# Altium schematic sheet TESTPOINTS.SchDoc
size A3; SheetNumber: 12; SheetTotal: 14
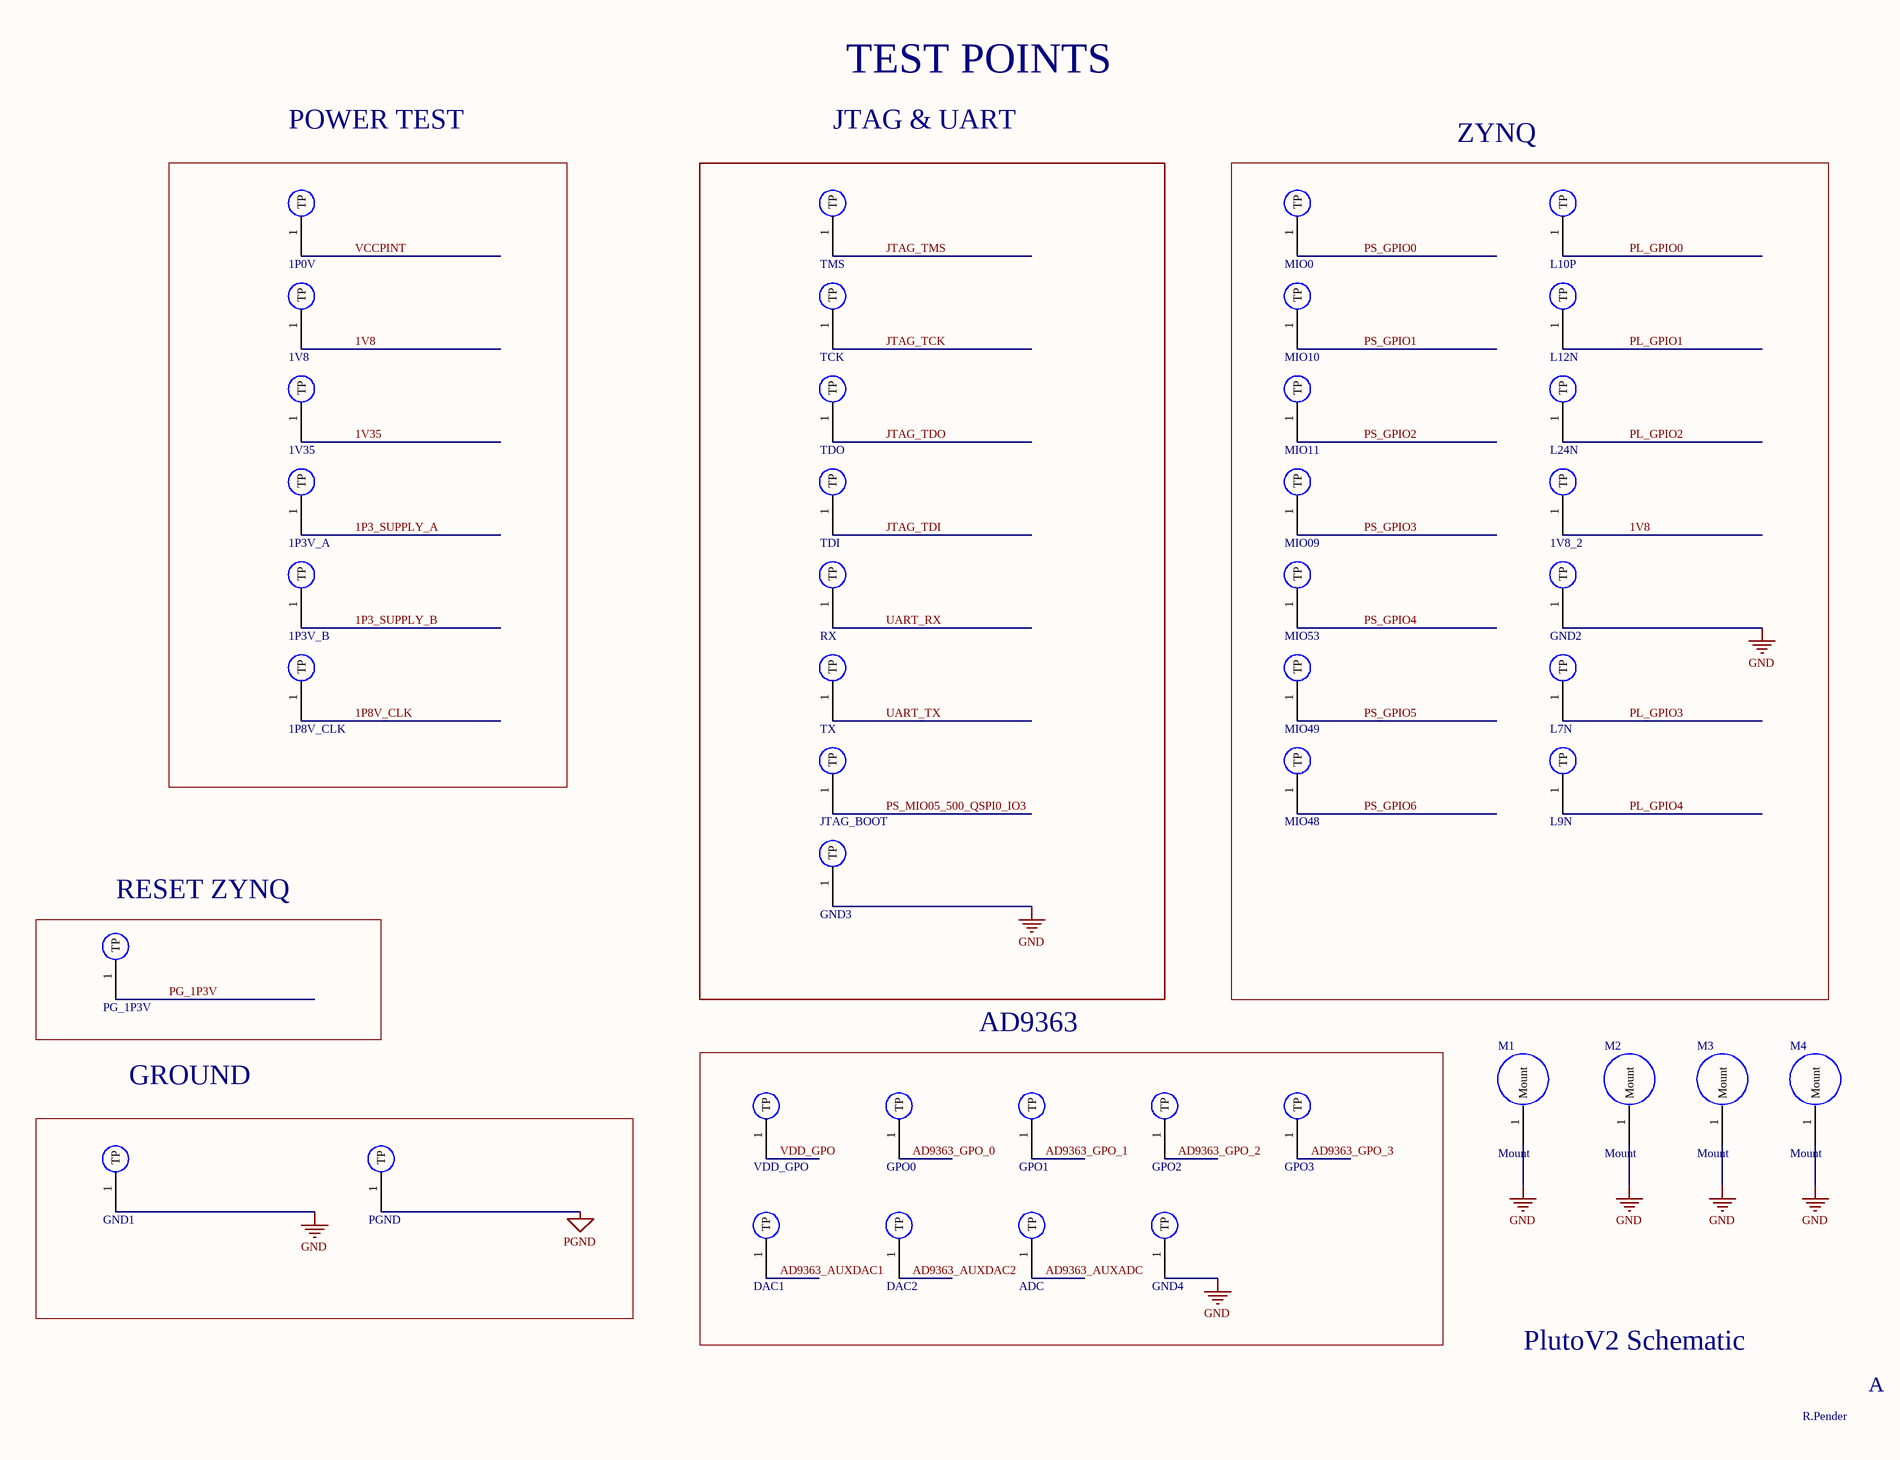
[diagram p0: TESTPOINTS.SchDoc, left]
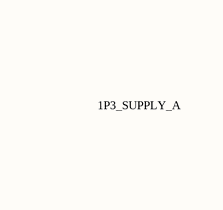
[diagram p1: TESTPOINTS.SchDoc, right]

## Parts
1P0V  TEST POINT  [TESTPOINT1]  (value not drawn)  (no BOM)
1P3V_A  TEST POINT  [TESTPOINT1]  (value not drawn)  (no BOM)
1P3V_B  TEST POINT  [TESTPOINT1]  (value not drawn)  (no BOM)
1P8V_CLK  TEST POINT  [TESTPOINT1]  (value not drawn)  (no BOM)
1V8  TEST POINT  [TESTPOINT1]  (value not drawn)  (no BOM)
1V8_2  TEST POINT  [TESTPOINT1]  (value not drawn)  (no BOM)
1V35  TEST POINT  [TESTPOINT1]  (value not drawn)  (no BOM)
ADC  TEST POINT  [TESTPOINT1]  (value not drawn)  (no BOM)
DAC1  TEST POINT  [TESTPOINT1]  (value not drawn)  (no BOM)
DAC2  TEST POINT  [TESTPOINT1]  (value not drawn)  (no BOM)
GND1  TEST POINT  [TESTPOINT1]  (value not drawn)  (no BOM)
GND2  TEST POINT  [TESTPOINT1]  (value not drawn)  (no BOM)
GND3  TEST POINT  [TESTPOINT1]  (value not drawn)  (no BOM)
GND4  TEST POINT  [TESTPOINT1]  (value not drawn)  (no BOM)
GPO0  TEST POINT  [TESTPOINT1]  (value not drawn)  (no BOM)
GPO1  TEST POINT  [TESTPOINT1]  (value not drawn)  (no BOM)
GPO2  TEST POINT  [TESTPOINT1]  (value not drawn)  (no BOM)
GPO3  TEST POINT  [TESTPOINT1]  (value not drawn)  (no BOM)
JTAG_BOOT  TEST POINT  [TESTPOINT1]  (value not drawn)  (no BOM)
L7N  TEST POINT  [TESTPOINT1]  (value not drawn)  (no BOM)
L9N  TEST POINT  [TESTPOINT1]  (value not drawn)  (no BOM)
L10P  TEST POINT  [TESTPOINT1]  (value not drawn)  (no BOM)
L12N  TEST POINT  [TESTPOINT1]  (value not drawn)  (no BOM)
L24N  TEST POINT  [TESTPOINT1]  (value not drawn)  (no BOM)
M1  Mount  [Mount]
M2  Mount  [Mount]
M3  Mount  [Mount]
M4  Mount  [Mount]
MIO0  TEST POINT  [TESTPOINT1]  (value not drawn)  (no BOM)
MIO09  TEST POINT  [TESTPOINT1]  (value not drawn)  (no BOM)
MIO10  TEST POINT  [TESTPOINT1]  (value not drawn)  (no BOM)
MIO11  TEST POINT  [TESTPOINT1]  (value not drawn)  (no BOM)
MIO48  TEST POINT  [TESTPOINT1]  (value not drawn)  (no BOM)
MIO49  TEST POINT  [TESTPOINT1]  (value not drawn)  (no BOM)
MIO53  TEST POINT  [TESTPOINT1]  (value not drawn)  (no BOM)
PG_1P3V  TEST POINT  [TESTPOINT1]  (value not drawn)  (no BOM)
PGND  TEST POINT  [TESTPOINT1]  (value not drawn)  (no BOM)
RX  TEST POINT  [TESTPOINT1]  (value not drawn)  (no BOM)
TCK  TEST POINT  [TESTPOINT1]  (value not drawn)  (no BOM)
TDI  TEST POINT  [TESTPOINT1]  (value not drawn)  (no BOM)
TDO  TEST POINT  [TESTPOINT1]  (value not drawn)  (no BOM)
TMS  TEST POINT  [TESTPOINT1]  (value not drawn)  (no BOM)
TX  TEST POINT  [TESTPOINT1]  (value not drawn)  (no BOM)
VDD_GPO  TEST POINT  [TESTPOINT1]  (value not drawn)  (no BOM)

## Blocks framed on the sheet
ZYNQ: 1V8_2 GND2 L7N L9N L10P L12N L24N MIO0 MIO09-MIO11 MIO48 MIO49 MIO53
RESET ZYNQ: PG_1P3V
AD9363: ADC DAC1 DAC2 GND4 GPO0-GPO3 VDD_GPO

## Nets
GND: GND1.1(TP) GND2.1(TP) GND3.1(TP) GND4.1(TP) M1.1(Mount) M2.1(Mount) M3.1(Mount) M4.1(Mount)
PGND: PGND.1(TP)
1P3_SUPPLY_A: 1P3V_A.1(TP)
1P3_SUPPLY_B: 1P3V_B.1(TP)
1P8V_CLK: 1P8V_CLK.1(TP)
1V8: 1V8.1(TP) 1V8_2.1(TP)
1V35: 1V35.1(TP)
AD9363_AUXADC: ADC.1(TP)
AD9363_AUXDAC1: DAC1.1(TP)
AD9363_AUXDAC2: DAC2.1(TP)
AD9363_GPO_0: GPO0.1(TP)
AD9363_GPO_1: GPO1.1(TP)
AD9363_GPO_2: GPO2.1(TP)
AD9363_GPO_3: GPO3.1(TP)
JTAG_TCK: TCK.1(TP)
JTAG_TDI: TDI.1(TP)
JTAG_TDO: TDO.1(TP)
JTAG_TMS: TMS.1(TP)
PG_1P3V: PG_1P3V.1(TP)
PL_GPIO0: L10P.1(TP)
PL_GPIO1: L12N.1(TP)
PL_GPIO2: L24N.1(TP)
PL_GPIO3: L7N.1(TP)
PL_GPIO4: L9N.1(TP)
PS_GPIO0: MIO0.1(TP)
PS_GPIO1: MIO10.1(TP)
PS_GPIO2: MIO11.1(TP)
PS_GPIO3: MIO09.1(TP)
PS_GPIO4: MIO53.1(TP)
PS_GPIO5: MIO49.1(TP)
PS_GPIO6: MIO48.1(TP)
PS_MIO05_500_QSPI0_IO3: JTAG_BOOT.1(TP)
UART_RX: RX.1(TP)
UART_TX: TX.1(TP)
VCCPINT: 1P0V.1(TP)
VDD_GPO: VDD_GPO.1(TP)

## Notes on the sheet
- TEST POINTS
- POWER TEST
- JTAG & UART
- 1P3_SUPPLY_A
- GROUND
- PlutoV2 Schematic
- A
- R.Pender

## Library data of the parts
1P0V 1P3V_A 1P3V_B 1P8V_CLK 1V8 1V8_2 1V35 ADC DAC1 DAC2 GND1-GND4 GPO0-GPO3 JTAG_BOOT L7N L9N L10P L12N L24N MIO0 MIO09-MIO11 MIO48 MIO49 MIO53 PG_1P3V PGND RX TCK TDI TDO TMS TX VDD_GPO = TESTPT